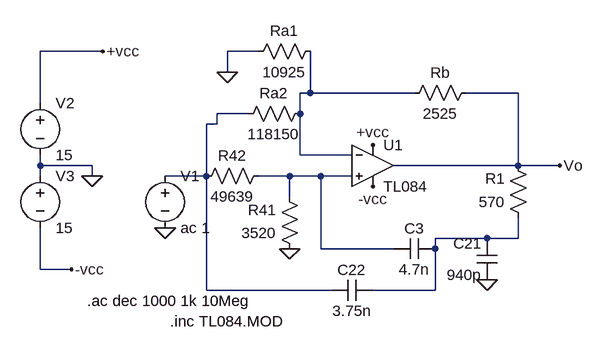
[diagram p0: schematic simEtapa2.asc]
simEtapa2.asc, the LTspice schematic file:
Version 4
SHEET 1 880 680
WIRE -192 -16 -288 -16
WIRE 48 -16 0 -16
WIRE 0 16 0 -16
WIRE 128 48 128 -16
WIRE 128 48 112 48
WIRE 288 48 128 48
WIRE 448 48 368 48
WIRE -288 64 -288 -16
WIRE 32 80 -16 80
WIRE 112 80 112 48
WIRE -16 96 -16 80
WIRE -16 96 -32 96
WIRE 112 144 112 80
WIRE 192 144 112 144
WIRE -288 160 -288 144
WIRE -208 160 -288 160
WIRE 448 160 448 48
WIRE 448 160 256 160
WIRE 512 160 448 160
WIRE -288 176 -288 160
WIRE -208 176 -208 160
WIRE -32 176 -32 96
WIRE -32 176 -96 176
WIRE 96 176 48 176
WIRE 144 176 96 176
WIRE 192 176 144 176
WIRE 96 208 96 176
WIRE 400 272 320 272
WIRE 448 272 448 240
WIRE 448 272 400 272
WIRE 144 288 144 176
WIRE 256 288 144 288
WIRE 320 288 320 272
WIRE -288 320 -288 256
WIRE -240 320 -288 320
WIRE -32 352 -32 176
WIRE 160 352 -32 352
WIRE 320 352 320 288
WIRE 320 352 224 352
FLAG 224 128 +vcc
FLAG 224 192 -vcc
FLAG 400 336 0
FLAG 96 288 0
FLAG -96 256 0
FLAG 512 160 Vo
FLAG -208 176 0
FLAG -192 -16 +vcc
FLAG -240 320 -vcc
FLAG 0 16 0
SYMBOL res 128 64 R90
WINDOW 0 0 56 VBottom 2
WINDOW 3 32 56 VTop 2
SYMATTR InstName Ra2
SYMATTR Value 118150
SYMBOL res 384 32 R90
WINDOW 0 0 56 VBottom 2
WINDOW 3 32 56 VTop 2
SYMATTR InstName Rb
SYMATTR Value 2525
SYMBOL res 464 256 R180
WINDOW 0 36 76 Left 2
WINDOW 3 36 40 Left 2
SYMATTR InstName R1
SYMATTR Value 570
SYMBOL res 112 304 R180
WINDOW 0 36 76 Left 2
WINDOW 3 36 40 Left 2
SYMATTR InstName R41
SYMATTR Value 3520
SYMBOL res -48 192 R270
WINDOW 0 32 56 VTop 2
WINDOW 3 0 56 VBottom 2
SYMATTR InstName R42
SYMATTR Value 49639
SYMBOL cap 320 272 R90
WINDOW 0 0 32 VBottom 2
WINDOW 3 32 32 VTop 2
SYMATTR InstName C3
SYMATTR Value 4.7n
SYMBOL cap 416 336 R180
WINDOW 0 24 56 Left 2
WINDOW 3 24 8 Left 2
SYMATTR InstName C21
SYMATTR Value 940p
SYMBOL cap 160 368 R270
WINDOW 0 32 32 VTop 2
WINDOW 3 0 32 VBottom 2
SYMATTR InstName C22
SYMATTR Value 3.75n
SYMBOL Opamps\\opamp2 224 96 R0
SYMATTR InstName U1
SYMATTR Value TL084
SYMBOL voltage -96 160 R0
SYMATTR InstName V1
SYMATTR Value ac 1
SYMBOL voltage -288 48 R0
SYMATTR InstName V2
SYMATTR Value 15
SYMBOL voltage -288 160 R0
SYMATTR InstName V3
SYMATTR Value 15
SYMBOL res 144 -32 R90
WINDOW 0 0 56 VBottom 2
WINDOW 3 32 56 VTop 2
SYMATTR InstName Ra1
SYMATTR Value 10925
TEXT -88 400 Left 2 !.inc TL084.MOD
TEXT -216 368 Left 2 !.ac dec 1000 1k 10Meg

The netlist it stands for:
* simEtapa2.asc
Ra2 N001 N002 118150
Rb Vo N001 2525
R1 N004 Vo 570
R41 0 N003 3520
R42 N002 N003 49639
C3 N004 N003 4.7n
C21 0 N004 940p
C22 N002 N004 3.75n
XU1 N003 N001 +vcc -vcc Vo TL084  ; pins In+ In- V+ V- OUT
V1 N002 0 ac 1
V2 +vcc 0 15
V3 0 -vcc 15
Ra1 N001 0 10925
.inc TL084.MOD
.ac dec 1000 1k 10Meg
.backanno
.end